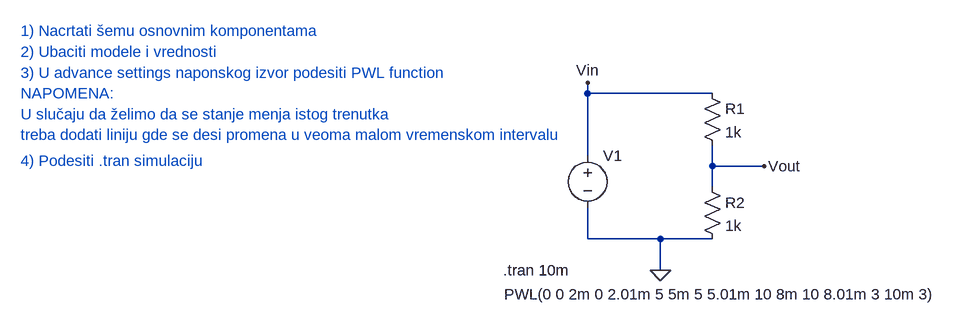
[diagram p0: schematic V3_PWL.asc]
V3_PWL.asc, the LTspice schematic file:
Version 4
SHEET 1 880 680
WIRE 0 0 0 -16
WIRE 192 0 0 0
WIRE 0 96 0 0
WIRE 192 112 192 80
WIRE 272 112 192 112
WIRE 192 144 192 112
WIRE 0 224 0 176
WIRE 112 224 0 224
WIRE 192 224 112 224
WIRE 112 272 112 224
FLAG 112 272 0
FLAG 0 -16 Vin
FLAG 272 112 Vout
SYMBOL voltage 0 80 R0
WINDOW 3 -128 229 Left 2
WINDOW 123 0 0 Left 0
WINDOW 39 0 0 Left 0
SYMATTR InstName V1
SYMATTR Value PWL(0 0 2m 0 2.01m 5 5m 5 5.01m 10 8m 10 8.01m 3 10m 3)
SYMBOL res 176 -16 R0
SYMATTR InstName R1
SYMATTR Value 1k
SYMBOL res 176 128 R0
SYMATTR InstName R2
SYMATTR Value 1k
TEXT -872 -96 Left 2 ;1) Nacrtati šemu osnovnim komponentama
TEXT -872 -64 Left 2 ;2) Ubaciti modele i vrednosti
TEXT -872 -32 Left 2 ;3) U advance settings naponskog izvor podesiti PWL function
TEXT -872 104 Left 2 ;4) Podesiti .tran simulaciju
TEXT -130 272 Left 2 !.tran 10m
TEXT -872 0 Left 2 ;NAPOMENA:
TEXT -872 32 Left 2 ;U slučaju da želimo da se stanje menja istog trenutka
TEXT -872 64 Left 2 ;treba dodati liniju gde se desi promena u veoma malom vremenskom intervalu

The netlist it stands for:
* V3_PWL.asc
V1 Vin 0 PWL(0 0 2m 0 2.01m 5 5m 5 5.01m 10 8m 10 8.01m 3 10m 3)
R1 Vin Vout 1k
R2 Vout 0 1k
* 1) Nacrtati šemu osnovnim komponentama
* 2) Ubaciti modele i vrednosti
* 3) U advance settings naponskog izvor podesiti PWL function
* 4) Podesiti .tran simulaciju
.tran 10m
* NAPOMENA:
* U slučaju da želimo da se stanje menja istog trenutka
* treba dodati liniju gde se desi promena u veoma malom vremenskom intervalu
.backanno
.end